# EAGLE design OperantFEDv6 (EAGLE 7.7.0)
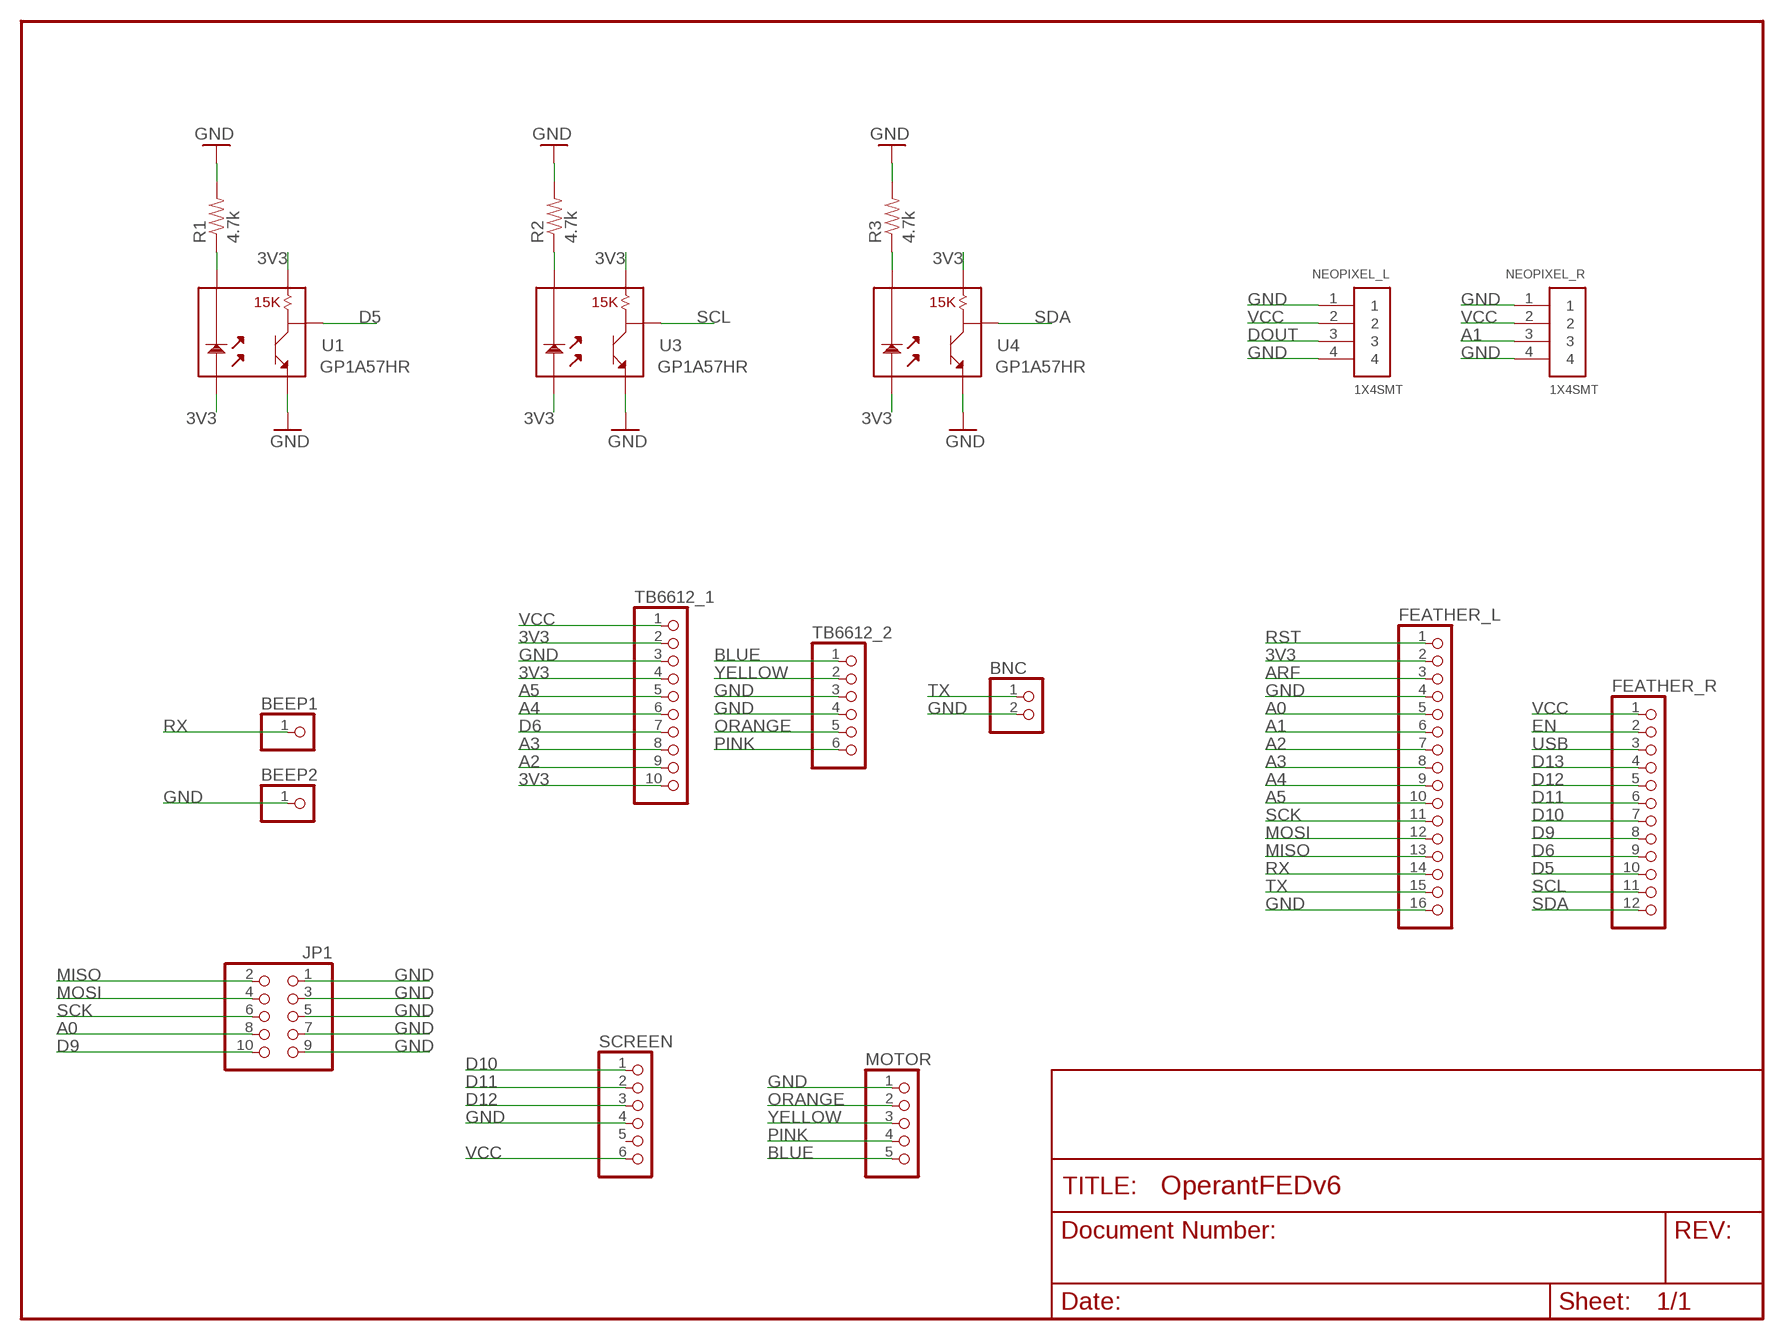
[diagram p0: schematic, sheet 1]

## Parts
BEEP1  PINHD-1X1  [1X01]
BEEP2  PINHD-1X1  [1X01]
BNC  PINHD-1X2  [1X02]
FEATHER_L  PINHD-1X16  [1X16]
FEATHER_R  PINHD-1X12  [1X12]
JP1  PINHD-2X5/90  [2X05/90]
MOTOR  PINHD-1X5  [1X05]
NEOPIXEL_L  1X4SMT  [1X4-SMT]
NEOPIXEL_R  1X4SMT  [1X4-SMT]
R1  4.7k  RESISTORPTH1  [AXIAL-0.3]
R2  4.7k  RESISTORPTH1  [AXIAL-0.3]
R3  4.7k  RESISTORPTH1  [AXIAL-0.3]
SCREEN  PINHD-1X6  [1X06]
TB6612_1  PINHD-1X10  [1X10]
TB6612_2  PINHD-1X6  [1X06]
U1  GP1A57HR  [GP1A57HR]
U3  GP1A57HR  [GP1A57HR]
U4  GP1A57HR  [GP1A57HR]

## Nets
3V3: FEATHER_L.2 TB6612_1.2 TB6612_1.4 TB6612_1.10 U1.1 U1.3 U3.1 U3.3 U4.1 U4.3
A0: FEATHER_L.5 JP1.8
A1: FEATHER_L.6 NEOPIXEL_R.3
A2: FEATHER_L.7 TB6612_1.9
A3: FEATHER_L.8 TB6612_1.8
A4: FEATHER_L.9 TB6612_1.6
A5: FEATHER_L.10 TB6612_1.5
ARF: FEATHER_L.3
BLUE: MOTOR.5 TB6612_2.1
D5: FEATHER_R.10 U1.4
D6: FEATHER_R.9 TB6612_1.7
D9: FEATHER_R.8 JP1.10
D10: FEATHER_R.7 SCREEN.1
D11: FEATHER_R.6 SCREEN.2
D12: FEATHER_R.5 SCREEN.3
D13: FEATHER_R.4
DOUT: NEOPIXEL_L.3
EN: FEATHER_R.2
GND: BEEP2.1 BNC.2 FEATHER_L.4 FEATHER_L.16 JP1.1 JP1.3 JP1.5 JP1.7 JP1.9 MOTOR.1 NEOPIXEL_L.1 NEOPIXEL_L.4 NEOPIXEL_R.1 NEOPIXEL_R.4 R1.P$2 R2.P$2 R3.P$2 SCREEN.4 TB6612_1.3 TB6612_2.3 TB6612_2.4 U1.5 U3.5 U4.5
MISO: FEATHER_L.13 JP1.2
MOSI: FEATHER_L.12 JP1.4
N$1: R2.P$1 U3.2
N$2: R1.P$1 U1.2
N$3: R3.P$1 U4.2
ORANGE: MOTOR.2 TB6612_2.5
PINK: MOTOR.4 TB6612_2.6
RST: FEATHER_L.1
RX: BEEP1.1 FEATHER_L.14
SCK: FEATHER_L.11 JP1.6
SCL: FEATHER_R.11 U3.4
SDA: FEATHER_R.12 U4.4
TX: BNC.1 FEATHER_L.15
USB: FEATHER_R.3
VCC: FEATHER_R.1 NEOPIXEL_L.2 NEOPIXEL_R.2 SCREEN.6 TB6612_1.1
YELLOW: MOTOR.3 TB6612_2.2
Unconnected: SCREEN.5

## Library data of the parts
BEEP1 BEEP2 = pinhead:PINHD-1X1: PIN HEADER
BNC = pinhead:PINHD-1X2: PIN HEADER
FEATHER_L = pinhead:PINHD-1X16: PIN HEADER
FEATHER_R = pinhead:PINHD-1X12: PIN HEADER
JP1 = pinhead:PINHD-2X5: PIN HEADER
MOTOR = pinhead:PINHD-1X5: PIN HEADER
NEOPIXEL_L NEOPIXEL_R = adafruit:1X4: 4-pin connector
R1-R3 = SparkFun:RESISTOR: Resistor Basic schematic elements and footprints for 0603, 1206, and PTH 1/10th watt (small) resistors.
SCREEN TB6612_2 = pinhead:PINHD-1X6: PIN HEADER
TB6612_1 = pinhead:PINHD-1X10: PIN HEADER
U1 U3 U4 = SparkFun:GP1A57HR

## Board
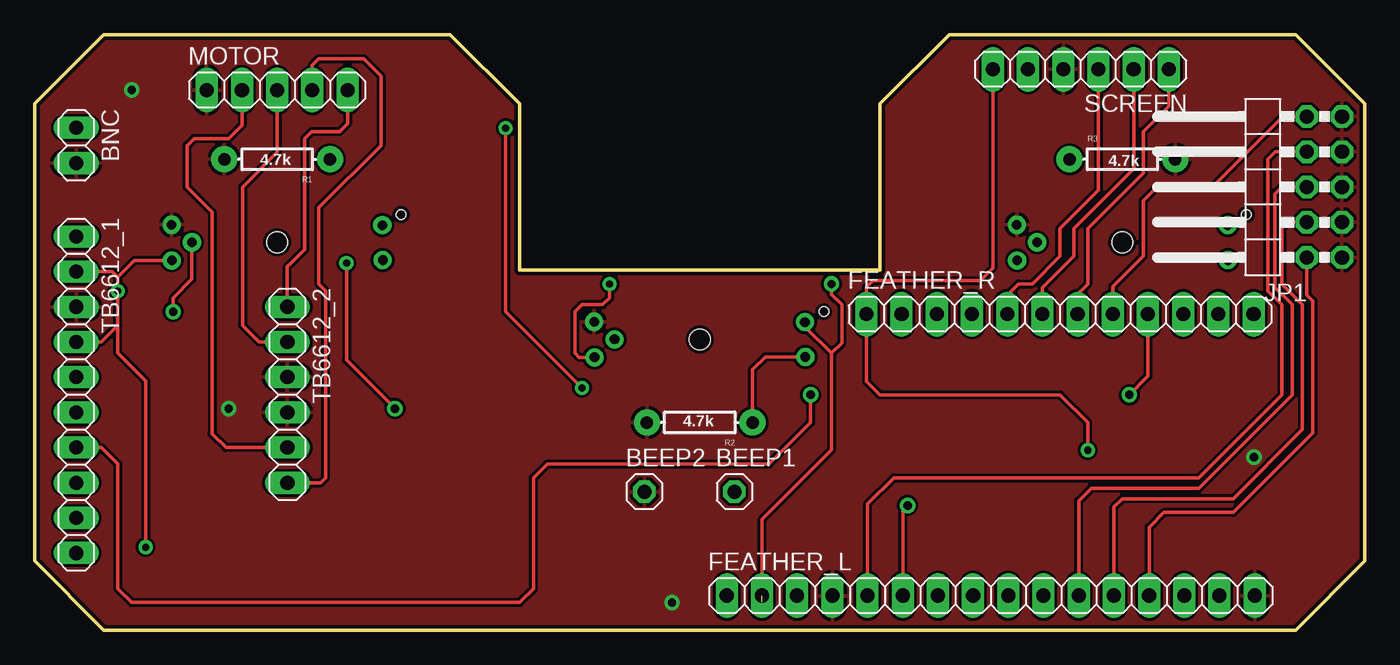
[diagram p1: board, top side]
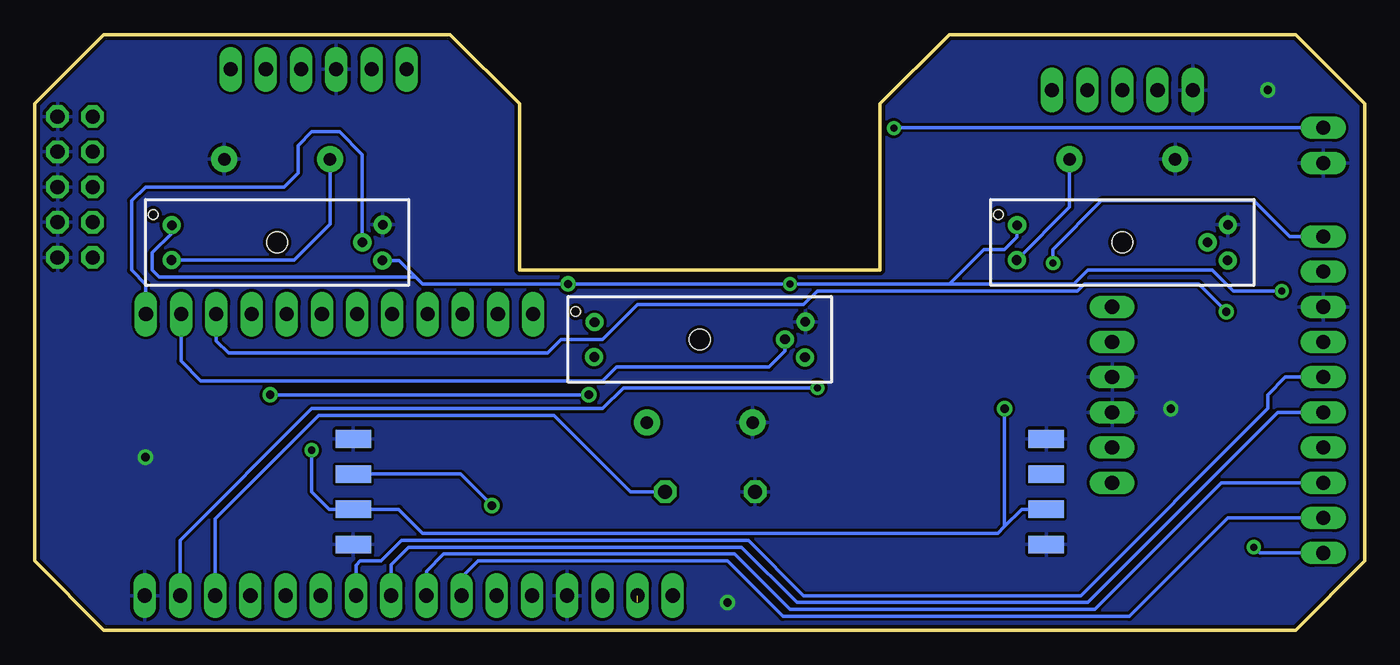
[diagram p2: board, bottom side, seen from below]

Size 96 x 43 mm. Coordinates in mm from the lower left corner, seen from the top.
Outline: 5,0 91,0 96,5 96,38 91,43 66,43 61,38 61,26 35,26 35,38 30,43 5,43 0,38 0,5 5,0
Copper layers (1*16): Top 0.0356mm / dielectric 1.5011mm / Bottom 0.0356mm
Design rules "default": minimum track width 8mil, minimum drill 20mil, track to track 8mil, track to pad 8mil, pad to pad 8mil, via to via 8mil, smd to smd 8mil, copper to edge 10mil, drill to drill 8mil, minimum pad ring 12mil, minimum via ring 10mil, stop-mask expansion 4mil, vias tented up to drill 20mil, thermal gap 10mil

### Footprints (pad centres in the part's own frame; a part is rotated, then mirrored left to right if it is on the bottom)
1X01 = drill 1.016 octagon: 1 0,0
1X02 = drill 1.016 long: 1 -1.27,0; 2 1.27,0
1X16 = drill 1.016 long: 1 -19.05,0; 2 -16.51,0; 3 -13.97,0; 4 -11.43,0; 5 -8.89,0; 6 -6.35,0; 7 -3.81,0; 8 -1.27,0; 9 1.27,0; 10 3.81,0; 11 6.35,0; 12 8.89,0; 13 11.43,0; 14 13.97,0; 15 16.51,0; 16 19.05,0
1X12 = drill 1.016 long: 1 -13.97,0; 2 -11.43,0; 3 -8.89,0; 4 -6.35,0; 5 -3.81,0; 6 -1.27,0; 7 1.27,0; 8 3.81,0; 9 6.35,0; 10 8.89,0; 11 11.43,0; 12 13.97,0
2X05/90 = drill 1.016 octagon: 1 -5.08,-6.35; 2 -5.08,-3.81; 3 -2.54,-6.35; 4 -2.54,-3.81; 5 0,-6.35; 6 0,-3.81; 7 2.54,-6.35; 8 2.54,-3.81; 9 5.08,-6.35; 10 5.08,-3.81
1X05 = drill 1.016 long: 1 -5.08,0; 2 -2.54,0; 3 0,0; 4 2.54,0; 5 5.08,0
1X4-SMT = smd 1.27 x 2.54: 1 -3.81,0; 2 -1.27,0; 3 1.27,0; 4 3.81,0
AXIAL-0.3 = drill 0.9 pad 1.88: P$1 -3.81,0; P$2 3.81,0
1X06 = drill 1.016 long: 1 -6.35,0; 2 -3.81,0; 3 -1.27,0; 4 1.27,0; 5 3.81,0; 6 6.35,0
1X10 = drill 1.016 long: 1 -11.43,0; 2 -8.89,0; 3 -6.35,0; 4 -3.81,0; 5 -1.27,0; 6 1.27,0; 7 3.81,0; 8 6.35,0; 9 8.89,0; 10 11.43,0
GP1A57HR = drill 0.7: 1 -7.6,1.24; 2 -7.62,-1.27; 3 7.6,-1.3; 4 6.15,0; 5 7.62,1.27 | hole 1.5: 0,0 | hole 0.7: -8.95,2

### Placement (x,y rotation side)
BEEP1  50.5,10 0 top
BEEP2  44,10 0 top
BNC  3,35 270 top
FEATHER_L  69,2.5 0 top
FEATHER_R  74,22.82 0 top
JP1  88,32 90 top
MOTOR  17.5,39 0 top
NEOPIXEL_L  23,10 90 bottom
NEOPIXEL_R  73,10 90 bottom
R1  17.5,34 180 top
R2  48,15 180 top
R3  78.5,34 0 top
SCREEN  75.5,40.5 180 top
TB6612_1  3,17 270 top
TB6612_2  18.24,17 270 top
U1  17.5,28 0 bottom
U3  48,21 0 bottom
U4  78.5,28 0 bottom

### Tracks (layer width: path | path; a pad name or v marks a point on that pad's centre or on a via)
3V3  (via drill 0.51, 0.6 pad 0.61)  (1 unrouted)
  Top 0.254: 6,22 6,20 8,18 v8,6 | 6,22 v6,24.5 6,25.5 | v41.5,25 41.5,24 41,23.5 39.5,23.5 39,23 39,20 39.3,19.7 U3.3 | 57.5,20 57.5,13 52.5,8 52.5,2 | U3.1 55.6,21.9 57.5,20 | 57.5,20 58.25,20.75 58.25,23.5 57.5,24.25 v57.5,25 | TB6612_1.4 4.81,20.81 6,22 | TB6612_1.2 5.61,25.89 6,25.5 | U1.3 7.2,26.7 6,25.5
  Bottom 0.254: 30,25 v41.5,25 v57.5,25 68,25 68.5,25.5 | 30,25 27.5,27.5 26,27.5 25.1,28.4 U1.1 | U4.1 86.1,28.65 87.5,27.25 87.5,26 87,25.5 68.5,25.5 | U4.3 69.7,26.7 68.5,25.5 | TB6612_1.10 7.57,5.57 v8,6 | v6,24.5 9.5,24.5 11,26 20,26 21,25 30,25
A0
  Top 0.254: FEATHER_L.5 60.11,9.11 62,11 84,11 90,17 90,23.5 89,24.5 89,34 89.54,34.54 JP1.8
A1  (via drill 0.6)
  Top 0.254: FEATHER_L.6 62.65,8.65 v63,9
  Bottom 0.254: v63,9 65.27,11.27 NEOPIXEL_R.3
A2
  Bottom 0.254: FEATHER_L.7 65.19,3.81 64,5 46,5 42,1 17,1 9.89,8.11 TB6612_1.9
A3
  Bottom 0.254: FEATHER_L.8 67.73,4.27 66.5,5.5 45.5,5.5 41.5,1.5 19.5,1.5 10.35,10.65 TB6612_1.8
A4
  Bottom 0.254: FEATHER_L.9 70.27,4.73 69,6 45,6 41,2 20,2 6.27,15.73 TB6612_1.6
A5
  Bottom 0.254: TB6612_1.5 5.73,18.27 7,17 7,16 20.5,2.5 40.5,2.5 44.5,6.5 69.5,6.5 71,5 72.5,5 72.81,4.69 FEATHER_L.10
BLUE
  Top 0.254: MOTOR.5 22.58,36.58 22,36 20,36 19.5,35.5 19.5,27.5 19,27 18.5,26.5 18.24,26.24 TB6612_2.1
D5  (via drill 0.6)
  Top 0.254: v10,23 10,24 11.35,25.35 U1.4
  Bottom 0.254: v10,23 12,25 20.25,25 20.75,24.5 39.5,24.5 40.5,23.5 52.5,23.5 55,21 58,21 59,20 82,20 82.89,20.89 FEATHER_R.10
D6  (via drill 0.6)
  Top 0.254: TB6612_1.7 4.81,13.19 6,12 6,3 7,2 35,2 36,3 36,11 37,12 53,12 56,15 v56,17 | FEATHER_R.9 80.35,18.35 v79,17
  Bottom 0.254: v56,17 v79,17
D9
  Top 0.254: FEATHER_R.8 77.81,24.81 80,27 80,31 81,32 85,32 90.08,37.08 JP1.10
D10
  Top 0.254: FEATHER_R.7 75.27,24.27 76,25 76,29 80,33 80,36 81.85,37.85 SCREEN.1
D11
  Top 0.254: FEATHER_R.6 72.73,24.73 75,27 75,29 79.31,33.31 SCREEN.2
D12
  Top 0.254: FEATHER_R.5 70.19,24.19 71,25 72,25 74,27 74,29 76.77,31.77 SCREEN.3
GND  (via drill 0.6 pad 0.81)
  other vias: 88,12.5 46,2 14,16 7,39
  pour Top: 0,38 5,43 30,43 35,38 35,26 61,26 61,38 66,43 91,43 96,38 96,5 91,0 5,0 0,5
  pour Bottom: 0,38 5,43 30,43 35,38 35,27 61,27 61,38 66,43 91,43 96,38 96,5 91,0 5,0 0,5
MISO
  Top 0.254: FEATHER_L.13 80.43,7.43 81.5,8.5 86.5,8.5 92.25,14.25 92.25,23.75 91.81,24.19 JP1.2
MOSI
  Top 0.254: FEATHER_L.12 77.89,8.89 78.5,9.5 86.5,9.5 91.5,14.5 91.5,23.5 90,25 90,29 90.46,29.46 JP1.4
N$1
  Top 0.254: U3.2 52.73,19.73 51.81,18.81 R2.P$1
N$2
  Bottom 0.254: R1.P$1 21.31,30.54 U1.2
N$3
  Bottom 0.254: U4.2 77.27,26.73 74.69,29.31 R3.P$1
ORANGE
  Top 0.254: MOTOR.2 14.96,36.46 14,35.5 11.5,35.5 11,35 11,32 12.81,30.19 12.81,14.19 13.81,13.19 TB6612_2.5
PINK
  Top 0.254: MOTOR.4 20.04,40.79 20.5,41.25 23.75,41.25 25,40 25,35 20.5,30.5 20.5,25 21,24.5 21,11 20.65,10.65 TB6612_2.6
RX
  Bottom 0.254: FEATHER_L.14 82.97,8.03 75.5,15.5 58.5,15.5 53,10 BEEP1.1
SCK
  Top 0.254: FEATHER_L.11 75.35,9.35 76.25,10.25 84,10.25 90.75,17 90.75,23.5 89.5,24.75 89.5,31.5 90,32 JP1.6
SCL
  Bottom 0.254: U3.4 41.85,20.15 43,19 54,19 55,18 84,18 85.43,19.43 FEATHER_R.11
SDA
  Bottom 0.254: U4.4 72.35,34.35 74,36 76,36 77,35 77,33 78,32 88,32 89,31 89,26 87.97,24.97 FEATHER_R.12
TX  (via drill 0.51)
  Top 0.254: v39.5,17.5 34,23 v34,36.25
  Bottom 0.254: FEATHER_L.15 85.5,2 85.5,6.5 76,16 55,16 53.5,17.5 v39.5,17.5 | BNC.1 33.98,36.27 v34,36.25
VCC  (via drill 0.51, 0.6)
  Top 0.254: v76,13 76,15 74,17 61,17 60.03,17.97 FEATHER_R.1 60.03,24.78 60.5,25.25 68.25,25.25 69.15,26.15 SCREEN.6 | v22.5,26.5 22.5,19.5 v26,16
  Bottom 0.254: 26,7.5 24.77,8.73 NEOPIXEL_L.2 | TB6612_1.1 5.43,28.43 8,31 19,31 22.5,27.5 v22.5,26.5 | v76,13 76,10 74.73,8.73 NEOPIXEL_R.2 69.73,8.73 68,7 26.5,7 26,7.5 | v26,16 26,7.5
YELLOW
  Top 0.254: MOTOR.3 17.5,34.5 15,32 15,22 16.19,20.81 TB6612_2.2